# Altium project Q24_ECU.PrjPcb (part 1 of 2)
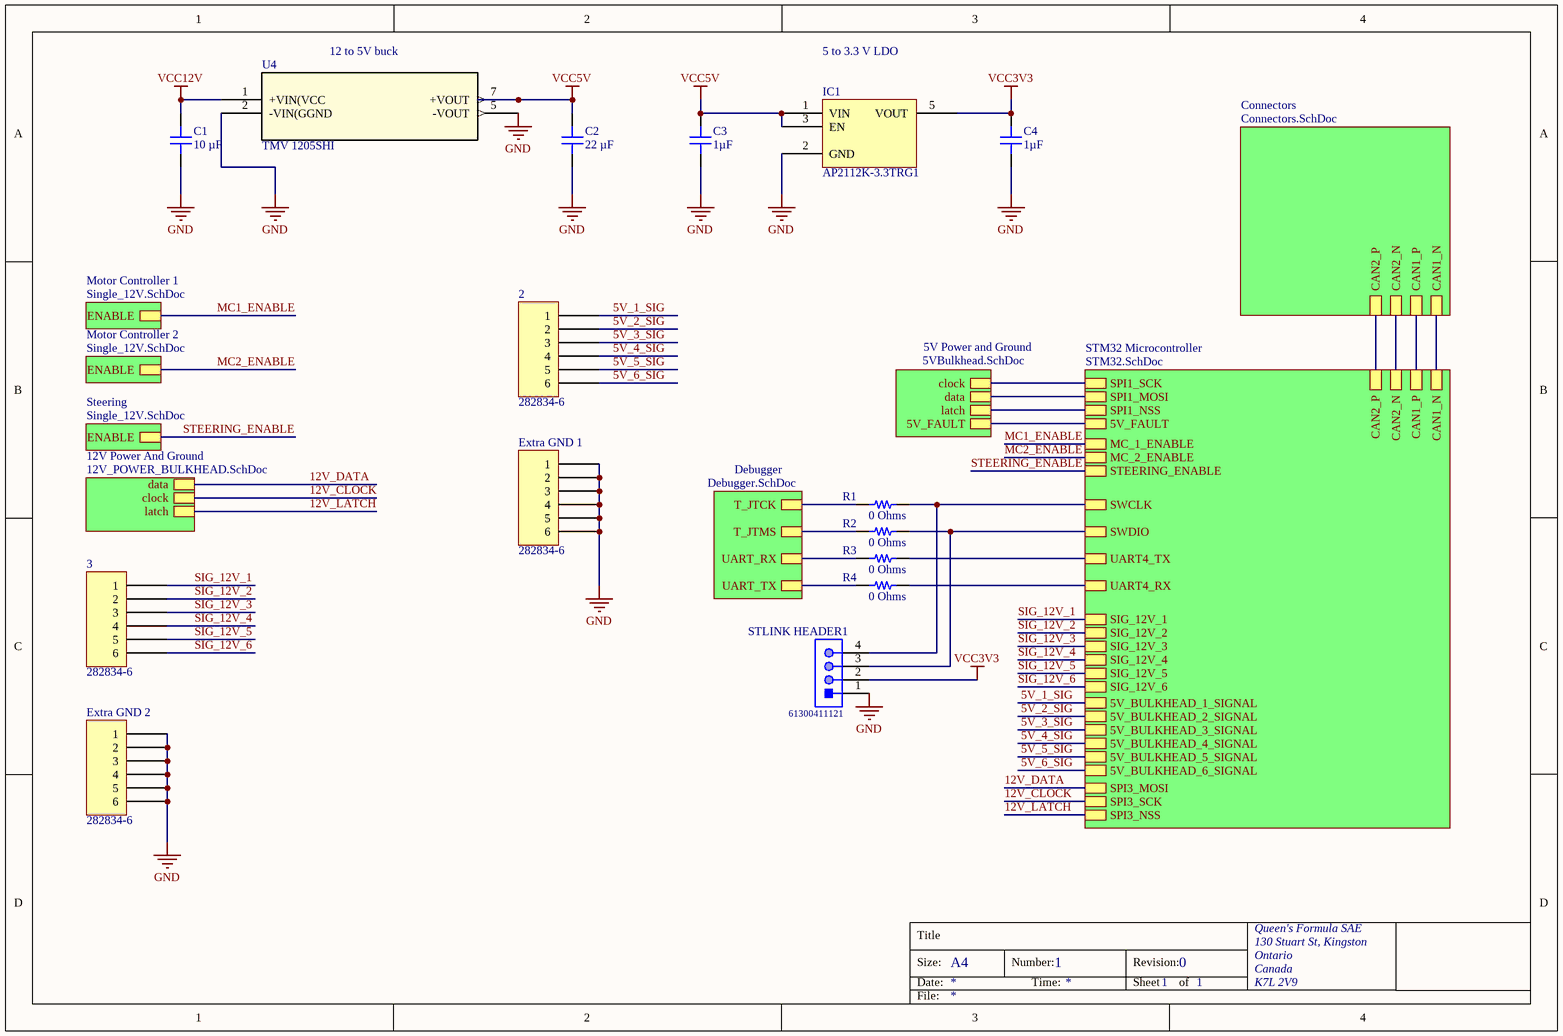
[diagram p0: TOP.SchDoc]
16 sheets, 186 parts. Net scope: hierarchical (ports join the sheet entries above them; power ports are global).
Board file: PCB.PcbDoc
Sheets:
  TOP.SchDoc
    STM32 Microcontroller = STM32.SchDoc
      CAN1 = CAN.SchDoc
      Accelerometer And Gyro = IMU.SchDoc
      CAN2 = CAN.SchDoc
    Motor Controller 1 = Single_12V.SchDoc
      Designator = 12V_LS.SchDoc
    Motor Controller 2 = Single_12V.SchDoc
      Designator = 12V_LS.SchDoc
    Steering = Single_12V.SchDoc
      Designator = 12V_LS.SchDoc
    Connectors = Connectors.SchDoc
    5V Power and Ground = 5VBulkhead.SchDoc
      Shift Register = shiftRegister.SchDoc
      5VLS1 = 5V_LS.SchDoc
      5VLS2 = 5V_LS.SchDoc
      5VLS3 = 5V_LS.SchDoc
      5VLS4 = 5V_LS.SchDoc
      5VLS5 = 5V_LS.SchDoc
      5VLS6 = 5V_LS.SchDoc
    Debugger = Debugger.SchDoc
      MCU = DebuggerMCU.SchDoc
      POWER = Power.SchDoc
      CONNECTORS = DebuggerConnectors.SchDoc
    12V Power And Ground = 12V_POWER_BULKHEAD.SchDoc
      Shift Register = shiftRegister.SchDoc
      Designator = 12V_LS.SchDoc
      Designator = 12V_LS.SchDoc
      Designator = 12V_LS.SchDoc
      Designator = 12V_LS.SchDoc
      Designator = 12V_LS.SchDoc
      Designator = 12V_LS.SchDoc
  Sheet1.SchDoc

## Sheet TOP.SchDoc: =DocumentName
size A4; Organization: Queen's Formula SAE; Address1: 130 Stuart St, Kingston; Address2: Ontario; Address3: Canada; Address4: K7L 2V9; DocumentNumber: 1; Revision: 0; SheetNumber: 1; SheetTotal: 1

### Parts
2  282834-6  [TE 282834-6]
3  282834-6  [TE 282834-6]
C1  10 µF  [CAP 0603_1608]
C2  22 µF  [CAP 0603_1608]
C3  1µF  [CAP 0402_1005]
C4  1µF  [CAP 0402_1005]
Extra_GND_1  282834-6  [TE 282834-6]
Extra_GND_2  282834-6  [TE 282834-6]
IC1  AP2112K-3.3TRG1  [DIODES SOT-23-5 W5]
R1  0 Ohms  [RES 0603_1608]
R2  0 Ohms  [RES 0603_1608]
R3  0 Ohms  [RES 0603_1608]
R4  0 Ohms  [RES 0603_1608]
STLINK_HEADER1  61300411121  [61300411121]
U4  TMV 1205SHI  [TMV-HI_SINGLE_TRP]

### Sub-sheets
5V Power and Ground = 5VBulkhead.SchDoc: data, clock, latch, 5V_FAULT
12V Power And Ground = 12V_POWER_BULKHEAD.SchDoc: data, clock, latch
Connectors = Connectors.SchDoc: CAN1_N, CAN1_P, CAN2_N, CAN2_P
Debugger = Debugger.SchDoc: T_JTCK, T_JTMS, UART_RX, UART_TX
Motor Controller 1 = Single_12V.SchDoc: ENABLE
Motor Controller 2 = Single_12V.SchDoc: ENABLE
Steering = Single_12V.SchDoc: ENABLE
STM32 Microcontroller = STM32.SchDoc: SPI1_NSS, SPI1_SCK, SPI1_MOSI, MC_1_ENABLE, MC_2_ENABLE, STEERING_ENABLE, CAN1_P, CAN1_N, 5V_BULKHEAD_1_SIGNAL, 5V_BULKHEAD_2_SIGNAL, 5V_BULKHEAD_3_SIGNAL, 5V_BULKHEAD_4_SIGNAL, 5V_BULKHEAD_5_SIGNAL, 5V_BULKHEAD_6_SIGNAL, CAN2_N, CAN2_P, SWCLK, SPI3_NSS, SPI3_MOSI, SPI3_SCK, SIG_12V_1, SIG_12V_2, SIG_12V_3, SIG_12V_4, SIG_12V_5, SIG_12V_6, SWDIO, UART4_TX, UART4_RX, 5V_FAULT

### Nets
GND: C1.1 C2.1 C3.1 C4.1 Extra_GND_1.1 Extra_GND_1.2 Extra_GND_1.3 Extra_GND_1.4 Extra_GND_1.5 Extra_GND_1.6 Extra_GND_2.1 Extra_GND_2.2 Extra_GND_2.3 Extra_GND_2.4 Extra_GND_2.5 Extra_GND_2.6 IC1.2(GND) STLINK_HEADER1.1 U4.2(-VIN(GGND) U4.5(-VOUT)
VCC3V3: C4.2 IC1.5(VOUT) STLINK_HEADER1.2
VCC5V: C2.2 C3.2 IC1.1(VIN) IC1.3(EN) U4.7(+VOUT)
VCC12V: C1.2 U4.1(+VIN(VCC)
5V_1_SIG: 2.1 ; sheet STM32 Microcontroller/5V_BULKHEAD_1_SIGNAL
5V_2_SIG: 2.2 ; sheet STM32 Microcontroller/5V_BULKHEAD_2_SIGNAL
5V_3_SIG: 2.3 ; sheet STM32 Microcontroller/5V_BULKHEAD_3_SIGNAL
5V_4_SIG: 2.4 ; sheet STM32 Microcontroller/5V_BULKHEAD_4_SIGNAL
5V_5_SIG: 2.5 ; sheet STM32 Microcontroller/5V_BULKHEAD_5_SIGNAL
5V_6_SIG: 2.6 ; sheet STM32 Microcontroller/5V_BULKHEAD_6_SIGNAL
12V_CLOCK: sheet STM32 Microcontroller/SPI3_SCK, sheet 12V Power And Ground/clock
12V_DATA: sheet STM32 Microcontroller/SPI3_MOSI, sheet 12V Power And Ground/data
12V_LATCH: sheet STM32 Microcontroller/SPI3_NSS, sheet 12V Power And Ground/latch
CAN1_N: sheet STM32 Microcontroller/CAN1_N, sheet Connectors/CAN1_N
CAN1_P: sheet STM32 Microcontroller/CAN1_P, sheet Connectors/CAN1_P
CAN2_N: sheet STM32 Microcontroller/CAN2_N, sheet Connectors/CAN2_N
CAN2_P: sheet STM32 Microcontroller/CAN2_P, sheet Connectors/CAN2_P
MC1_ENABLE: sheet STM32 Microcontroller/MC_1_ENABLE, sheet Motor Controller 1/ENABLE
MC2_ENABLE: sheet STM32 Microcontroller/MC_2_ENABLE, sheet Motor Controller 2/ENABLE
SIG_12V_1: 3.1 ; sheet STM32 Microcontroller/SIG_12V_1
SIG_12V_2: 3.2 ; sheet STM32 Microcontroller/SIG_12V_2
SIG_12V_3: 3.3 ; sheet STM32 Microcontroller/SIG_12V_3
SIG_12V_4: 3.4 ; sheet STM32 Microcontroller/SIG_12V_4
SIG_12V_5: 3.5 ; sheet STM32 Microcontroller/SIG_12V_5
SIG_12V_6: 3.6 ; sheet STM32 Microcontroller/SIG_12V_6
STEERING_ENABLE: sheet STM32 Microcontroller/STEERING_ENABLE, sheet Steering/ENABLE
T_JTCK: R1.1 ; sheet Debugger/T_JTCK
T_JTMS: R2.1 ; sheet Debugger/T_JTMS
UART_RX: R3.1 ; sheet Debugger/UART_RX
UART_TX: R4.1 ; sheet Debugger/UART_TX
NetIC2_14: R3.2 ; sheet STM32 Microcontroller/UART4_TX
NetIC2_15: R4.2 ; sheet STM32 Microcontroller/UART4_RX
NetIC2_20: sheet STM32 Microcontroller/SPI1_NSS, sheet 5V Power and Ground/latch
NetIC2_21: sheet STM32 Microcontroller/SPI1_SCK, sheet 5V Power and Ground/clock
NetIC2_23: sheet STM32 Microcontroller/SPI1_MOSI, sheet 5V Power and Ground/data
NetIC2_42: sheet STM32 Microcontroller/5V_FAULT, sheet 5V Power and Ground/5V_FAULT
NetIC2_46: R2.2 STLINK_HEADER1.3 ; sheet STM32 Microcontroller/SWDIO
NetIC2_49: R1.2 STLINK_HEADER1.4 ; sheet STM32 Microcontroller/SWCLK

### Notes on the sheet
- (near U4) 12 to 5V buck
- 5 to 3.3 V LDO
- Title
- Size:
- Date:
- A4
- Number:
- Time:
- Revision:
- Sheet
- of
- File:

### Library data of the parts
2 3 Extra_GND_1 Extra_GND_2 = 282834-6: TERM BLK 6P SIDE ENT 2.54MM PCB; Manufacturer: TE Connectivity AMP Connectors; Current: 10A; Mating Orientation: Horizontal with Board; Number of Levels: 1; Pitch: 0.100" (2.54mm); Positions Per Level: 6; Voltage: 150V; Wire Gauge: 16-30 AWG; Wire Termination: Screw - Rising Cage Clamp; Part Number: 282834-6; Color: Green; ComponentLink1Description: Datasheet; ComponentLink1URL: https://www.te.com/commerce/DocumentDelivery/DDEController?Action=srchrtrv&DocNm=282834&DocType=Customer+Drawing&DocLang=English; ComponentLink2Description: DigiKey Link; ComponentLink2URL: http://digikey.com/product-detail/en/te-connectivity-amp-connectors/282834-6/A98337-ND/1153267; LastUpdated: 2020-01-15 4:16:31 AM; Lifecycle Status: Active; Minimum Order: 1; Mounting Type: Through Hole; Packaging: Bulk; Part Status: Active; Price: 4.72; Series: Buchanan; Supplier 1: DigiKey; Supplier Part Number 1: A98337-ND
C1 = GRT188R61C106ME13D: CAP CER 10UF 16V X5R 0603; manufacturer: Murata Electronics; Tolerance: ±20%; Part Number: GRT188R61C106ME13D; Value: 10 µF; Applications: Automotive; Capacitance: 10 µF; componentlink1description: Datasheet; componentlink1url: https://search.murata.co.jp/Ceramy/image/img/A01X/G101/ENG/GRT188R61C106ME13-01.pdf; componentlink2description: DigiKey Link; componentlink2url: https://www.digikey.com/en/products/detail/murata-electronics/GRT188R61C106ME13D/5416740; Device Package: 0603 (1608 Metric); lastupdated: 2023-06-11 7:15:06 PM; Lifecycle Status: Active; Minimum Order: 1; Mounting Type: Surface Mount, MLCC; Operating Temperature: -55°C ~ 85°C; Package / Case: 0603 (1608 Metric); packaging: TapeAndReel; partid: 2515; Part Status: Active; price: 0.06; Ratings: AEC-Q200; series: GRT; Size / Dimension: 0.063" L x 0.031" W (1.60mm x 0.80mm); Supplier 1: DigiKey; Supplier Part Number 1: 490-12318-1-ND; Temperature Coefficient: X5R; Thickness (Max): 0.035" (0.90mm); Voltage - Rated: 16V
C2 = ZRB186R60J226ME11L: CAP CER 22UF 6.3V X5R 0603; manufacturer: Murata Electronics; Tolerance: ±20%; Part Number: ZRB186R60J226ME11L; Value: 22 µF; Applications: Acoustic Noise Reduction; Capacitance: 22 µF; componentlink1description: Datasheet; componentlink1url: https://psearch.en.murata.com/capacitor/product/ZRB186R60J226ME11%23.pdf; componentlink2description: DigiKey Link; componentlink2url: https://www.digikey.com/en/products/detail/murata-electronics/ZRB186R60J226ME11L/5877417; Device Package: 0603 (1608 Metric); Features: Interposer Termination; lastupdated: 2023-06-11 7:15:06 PM; Lifecycle Status: Active; Minimum Order: 1; Mounting Type: Surface Mount, MLCC; Operating Temperature: -55°C ~ 85°C; Package / Case: 0603 (1608 Metric); packaging: TapeAndReel; partid: 2449; Part Status: Active; price: 0.05; series: ZRB; Size / Dimension: 0.063" L x 0.031" W (1.60mm x 0.80mm); Supplier 1: DigiKey; Supplier Part Number 1: 490-13254-1-ND; Temperature Coefficient: X5R; Thickness (Max): 0.031" (0.80mm); Voltage - Rated: 6.3V
C3 C4 = 0402ZD105KAT4A: CAP CER 1UF 10V X5R 0402; Manufacturer: AVX Corporation; Tolerance: ±10%; Part Number: 0402ZD105KAT4A; Value: 1µF; Applications: General Purpose; Capacitance: 1µF; ComponentLink1Description: Datasheet; ComponentLink1URL: http://datasheets.avx.com/cx5r.pdf; ComponentLink2Description: DigiKey Link; ComponentLink2URL: http://digikey.com/product-detail/en/avx-corporation/0402ZD105KAT4A/478-10063-1-ND/6564285; Device Package: 0402 (1005 Metric); LastUpdated: 2020-09-02 1:02:25 AM; Lifecycle Status: Active; Minimum Order: 1; Mounting Type: Surface Mount, MLCC; Operating Temperature: -55°C ~ 85°C; Package / Case: 0402 (1005 Metric); Packaging: TapeAndReel; PartId: 1846; Part Status: Active; Price: 0.02; Series: -; Size / Dimension: 0.039" L x 0.020" W (1.00mm x 0.50mm); Supplier 1: DigiKey; Supplier Part Number 1: 478-10063-1-ND; Temperature Coefficient: X5R; Thickness (Max): 0.022" (0.56mm); Voltage - Rated: 10V
IC1 = AP2112K-3.3TRG1: IC REG LINEAR 3.3V 600MA SOT25; Manufacturer: Diodes Incorporated; Control Features: Enable; Current - Quiescent (Iq): 80µA; Number of Regulators: 1; Output Configuration: Positive; Output Type: Fixed; Protection Features: Over Current, Over Temperature; PSRR: 65sB (100Hz ~ 1KHz); Voltage Dropout (Max): 0.4V @ 600mA; Voltage - Input (Max): 6V; Part Number: AP2112K-3.3TRG1; ComponentLink1Description: Datasheet; ComponentLink1URL: https://www.diodes.com/assets/Datasheets/AP2112.pdf; ComponentLink2Description: DigiKey Link; ComponentLink2URL: http://digikey.com/product-detail/en/diodes-incorporated/AP2112K-3.3TRG1/AP2112K-3.3TRG1DICT-ND/4505257; Current - Output: 600mA; LastUpdated: 2020-09-02 1:25:56 AM; Lifecycle Status: Active; Minimum Order: 1; Mounting Type: Surface Mount; Operating Temperature: -40°C ~ 85°C; Package / Case: SC-74A, SOT-753; Packaging: TapeAndReel; Part Status: Active; Price: 0.10; Series: -; Supplier 1: DigiKey; Supplier Part Number 1: AP2112K-3.3TRG1DICT-ND; Supplier Device Package: SOT-25; Voltage - Output (Min/Fixed): 3.3V
R1-R4 = TLRZ1JTTD: RES 0 OHM JUMPER 0603; Manufacturer: KOA Speer Electronics, Inc.; Part Number: TLRZ1JTTD; Value: 0 Ohms; ComponentLink1Description: Datasheet; ComponentLink1URL: http://www.koaspeer.com/catimages/Products/TLRZ/TLRZ.pdf; ComponentLink2Description: DigiKey Link; ComponentLink2URL: https://www.digikey.com/en/products/detail/koa-speer-electronics-inc/TLRZ1JTTD/9845493; Composition: Metal Element; Device Package: 0603 (1608 Metric); Features: Automotive AEC-Q200, Current Sense; Height - Seated (Max): 0.022" (0.55mm); LastUpdated: 2023-06-11 7:43:49 PM; Lifecycle Status: Active; Minimum Order: 1; Number of Terminations: 2; Operating Temperature: -55°C ~ 170°C; Package / Case: 0603 (1608 Metric); Packaging: TapeAndReel; PartId: 4851; Part Status: Active; Price: 0.08; Ratings: AEC-Q200; Resistance: 0 Ohms; Series: TLRZ; Size / Dimension: 0.063" L x 0.031" W (1.60mm x 0.80mm); Supplier 1: DigiKey; Supplier Part Number 1: 2019-TLRZ1JTTDCT-ND; Supplier Device Package: 0603; Tolerance: Jumper
STLINK_HEADER1 = CMP-1502-01064-1: THT Vertical Pin Header WR-PHD, Pitch 2.54 mm, Single Row, 4 pins; Manufacturer: Wurth Elektronik; Withstanding Voltage: 500VAC; Rated Current: 3A; Working Voltage: 250VAC; Pin Number: 4; Gender: Male; Contact Resistance: 20mOhm; Pitch: 2.54mm; Manufacturer URL: http://www.we-online.de; Operating Temperature: -40to105degC; Packaging: Bag; Mounting Technology: THT; Package Reference: 61300411121; Datasheet URL: https://katalog.we-online.de/em/datasheet/6130xx11121.pdf; Publisher: WurthElektronik; Part Number: 61300411121; Row Number: Single; Orientation: Vertical
U4 = CMP-01539-51129758-1: TMV 1205SHI Iso DC-DC Converter; Vin 10.8 to 13.2Vdc; Vout 5Vdc; I/O isolation 5200Vdc; Output Current: 200mA; Isolation Voltage: 5.2kV; Number of Outputs: 1; Output Voltage: 5V; Efficiency: 71%; Output Power: 1W; Max Operating Temperature: 85°C; Height: 10.2mm; Width: 7.5mm; Mount: Through Hole; Depth: 10.2mm; NexarPartId: 51129758; RoHS: Compliant; Min Operating Temperature: -40°C; Length: 19.5mm

## Sheet STM32.SchDoc
size A4
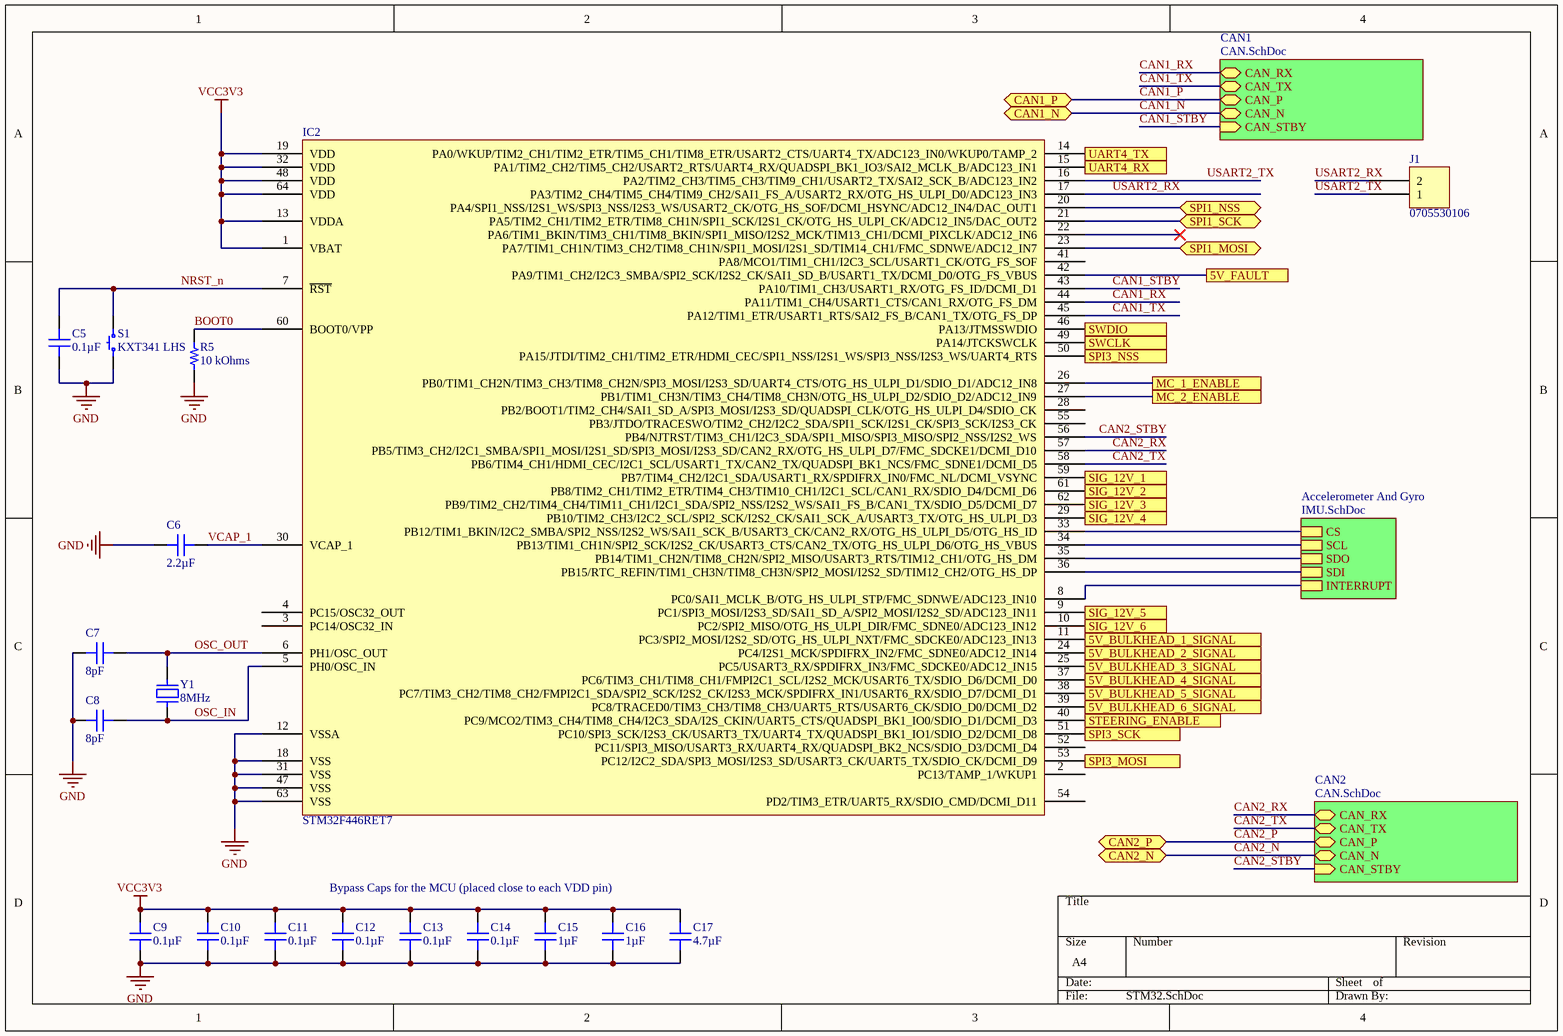
[diagram p1: STM32.SchDoc]

### Parts
C5  0.1µF  [CAP 0402_1005]
C6  2.2µF  [CAP 0402_1005]
C7  8pF  [CAP 0402_1005]
C8  8pF  [CAP 0402_1005]
C9  0.1µF  [CAP 0402_1005]
C10  0.1µF  [CAP 0402_1005]
C11  0.1µF  [CAP 0402_1005]
C12  0.1µF  [CAP 0402_1005]
C13  0.1µF  [CAP 0402_1005]
C14  0.1µF  [CAP 0402_1005]
C15  1µF  [CAP 0402_1005]
C16  1µF  [CAP 0402_1005]
C17  4.7µF  [CAP 0402_1005]
IC2  STM32F446RET7  [ST LQFP-64 10X10MM]
J1  0705530106  [MOLEX SDA-70553-2PIN]
R5  10 kOhms  [RES 0402_1005]
S1  KXT341 LHS  [C&K KXT3]
Y1  8MHz  [NDK NX3225GD]

### Sub-sheets
Accelerometer And Gyro = IMU.SchDoc: CS, SCL, SDO, SDI, INTERRUPT
CAN1 = CAN.SchDoc: CAN_RX (bidir), CAN_TX (bidir), CAN_STBY (in), CAN_P (bidir), CAN_N (bidir)
CAN2 = CAN.SchDoc: CAN_RX (bidir), CAN_TX (bidir), CAN_STBY (in), CAN_P (bidir), CAN_N (bidir)

### Ports
5V_BULKHEAD_1_SIGNAL, 5V_BULKHEAD_2_SIGNAL, 5V_BULKHEAD_3_SIGNAL, 5V_BULKHEAD_4_SIGNAL, 5V_BULKHEAD_5_SIGNAL, 5V_BULKHEAD_6_SIGNAL, 5V_FAULT, CAN1_N (bidir), CAN1_P (bidir), CAN2_N (bidir), CAN2_P (bidir), MC_1_ENABLE, MC_2_ENABLE, SIG_12V_1, SIG_12V_2, SIG_12V_3, SIG_12V_4, SIG_12V_5, SIG_12V_6, SPI1_MOSI (bidir), SPI1_NSS (bidir), SPI1_SCK (bidir), SPI3_MOSI, SPI3_NSS, SPI3_SCK, STEERING_ENABLE, SWCLK, SWDIO, UART4_RX, UART4_TX

### Nets
GND: C5.1 C6.2 C7.1 C8.1 C9.1 C10.1 C11.1 C12.1 C13.1 C14.1 C15.1 C16.1 C17.1 IC2.12(VSSA) IC2.18(VSS) IC2.31(VSS) IC2.47(VSS) IC2.63(VSS) R5.1 S1.1
VCC3V3: C9.2 C10.2 C11.2 C12.2 C13.2 C14.2 C15.2 C16.2 C17.2 IC2.1(VBAT) IC2.13(VDDA) IC2.19(VDD) IC2.32(VDD) IC2.48(VDD) IC2.64(VDD)
5V_1_SIG: IC2.11(PC3/SPI2_MOSI/I2S2_SD/OTG_HS_ULPI_NXT/FMC_SDCKE0/ADC123_IN13) ; port 5V_BULKHEAD_1_SIGNAL
5V_2_SIG: IC2.24(PC4/I2S1_MCK/SPDIFRX_IN2/FMC_SDNE0/ADC12_IN14) ; port 5V_BULKHEAD_2_SIGNAL
5V_3_SIG: IC2.25(PC5/USART3_RX/SPDIFRX_IN3/FMC_SDCKE0/ADC12_IN15) ; port 5V_BULKHEAD_3_SIGNAL
5V_4_SIG: IC2.37(PC6/TIM3_CH1/TIM8_CH1/FMPI2C1_SCL/I2S2_MCK/USART6_TX/SDIO_D6/DCMI_D0) ; port 5V_BULKHEAD_4_SIGNAL
5V_5_SIG: IC2.38(PC7/TIM3_CH2/TIM8_CH2/FMPI2C1_SDA/SPI2_SCK/I2S2_CK/I2S3_MCK/SPDIFRX_IN1/USART6_RX/SDIO_D7/DCMI_D1) ; port 5V_BULKHEAD_5_SIGNAL
5V_6_SIG: IC2.39(PC8/TRACED0/TIM3_CH3/TIM8_CH3/UART5_RTS/USART6_CK/SDIO_D0/DCMI_D2) ; port 5V_BULKHEAD_6_SIGNAL
12V_CLOCK: IC2.51(PC10/SPI3_SCK/I2S3_CK/USART3_TX/UART4_TX/QUADSPI_BK1_IO1/SDIO_D2/DCMI_D8) ; port SPI3_SCK
12V_DATA: IC2.53(PC12/I2C2_SDA/SPI3_MOSI/I2S3_SD/USART3_CK/UART5_TX/SDIO_CK/DCMI_D9) ; port SPI3_MOSI
12V_LATCH: IC2.50(PA15/JTDI/TIM2_CH1/TIM2_ETR/HDMI_CEC/SPI1_NSS/I2S1_WS/SPI3_NSS/I2S3_WS/UART4_RTS) ; port SPI3_NSS
BOOT0: IC2.60(BOOT0/VPP) R5.2
CAN1_N: port CAN1_N, sheet CAN1/CAN_N
CAN1_P: port CAN1_P, sheet CAN1/CAN_P
CAN1_RX: IC2.44(PA11/TIM1_CH4/USART1_CTS/CAN1_RX/OTG_FS_DM) ; sheet CAN1/CAN_RX
CAN1_STBY: IC2.43(PA10/TIM1_CH3/USART1_RX/OTG_FS_ID/DCMI_D1) ; sheet CAN1/CAN_STBY
CAN1_TX: IC2.45(PA12/TIM1_ETR/USART1_RTS/SAI2_FS_B/CAN1_TX/OTG_FS_DP) ; sheet CAN1/CAN_TX
CAN2_N: port CAN2_N, sheet CAN2/CAN_N
CAN2_P: port CAN2_P, sheet CAN2/CAN_P
CAN2_RX: IC2.57(PB5/TIM3_CH2/I2C1_SMBA/SPI1_MOSI/I2S1_SD/SPI3_MOSI/I2S3_SD/CAN2_RX/OTG_HS_ULPI_D7/FMC_SDCKE1/DCMI_D10) ; sheet CAN2/CAN_RX
CAN2_STBY: IC2.56(PB4/NJTRST/TIM3_CH1/I2C3_SDA/SPI1_MISO/SPI3_MISO/SPI2_NSS/I2S2_WS) ; sheet CAN2/CAN_STBY
CAN2_TX: IC2.58(PB6/TIM4_CH1/HDMI_CEC/I2C1_SCL/USART1_TX/CAN2_TX/QUADSPI_BK1_NCS/FMC_SDNE1/DCMI_D5) ; sheet CAN2/CAN_TX
MC1_ENABLE: IC2.26(PB0/TIM1_CH2N/TIM3_CH3/TIM8_CH2N/SPI3_MOSI/I2S3_SD/UART4_CTS/OTG_HS_ULPI_D1/SDIO_D1/ADC12_IN8) ; port MC_1_ENABLE
MC2_ENABLE: IC2.27(PB1/TIM1_CH3N/TIM3_CH4/TIM8_CH3N/OTG_HS_ULPI_D2/SDIO_D2/ADC12_IN9) ; port MC_2_ENABLE
NRST_n: C5.2 IC2.7(~{RST}) S1.2
OSC_IN: C8.2 IC2.5(PH0/OSC_IN) Y1.1
OSC_OUT: C7.2 IC2.6(PH1/OSC_OUT) Y1.2
SIG_12V_1: IC2.59(PB7/TIM4_CH2/I2C1_SDA/USART1_RX/SPDIFRX_IN0/FMC_NL/DCMI_VSYNC) ; port SIG_12V_1
SIG_12V_2: IC2.61(PB8/TIM2_CH1/TIM2_ETR/TIM4_CH3/TIM10_CH1/I2C1_SCL/CAN1_RX/SDIO_D4/DCMI_D6) ; port SIG_12V_2
SIG_12V_3: IC2.62(PB9/TIM2_CH2/TIM4_CH4/TIM11_CH1/I2C1_SDA/SPI2_NSS/I2S2_WS/SAI1_FS_B/CAN1_TX/SDIO_D5/DCMI_D7) ; port SIG_12V_3
SIG_12V_4: IC2.29(PB10/TIM2_CH3/I2C2_SCL/SPI2_SCK/I2S2_CK/SAI1_SCK_A/USART3_TX/OTG_HS_ULPI_D3) ; port SIG_12V_4
SIG_12V_5: IC2.9(PC1/SPI3_MOSI/I2S3_SD/SAI1_SD_A/SPI2_MOSI/I2S2_SD/ADC123_IN11) ; port SIG_12V_5
SIG_12V_6: IC2.10(PC2/SPI2_MISO/OTG_HS_ULPI_DIR/FMC_SDNE0/ADC123_IN12) ; port SIG_12V_6
STEERING_ENABLE: IC2.40(PC9/MCO2/TIM3_CH4/TIM8_CH4/I2C3_SDA/I2S_CKIN/UART5_CTS/QUADSPI_BK1_IO0/SDIO_D1/DCMI_D3) ; port STEERING_ENABLE
USART2_RX: IC2.17(PA3/TIM2_CH4/TIM5_CH4/TIM9_CH2/SAI1_FS_A/USART2_RX/OTG_HS_ULPI_D0/ADC123_IN3) J1.2
USART2_TX: IC2.16(PA2/TIM2_CH3/TIM5_CH3/TIM9_CH1/USART2_TX/SAI2_SCK_B/ADC123_IN2) J1.1
VCAP_1: C6.1 IC2.30(VCAP_1)
NetIC2_8: IC2.8(PC0/SAI1_MCLK_B/OTG_HS_ULPI_STP/FMC_SDNWE/ADC123_IN10) ; sheet Accelerometer And Gyro/INTERRUPT
NetIC2_14: IC2.14(PA0/WKUP/TIM2_CH1/TIM2_ETR/TIM5_CH1/TIM8_ETR/USART2_CTS/UART4_TX/ADC123_IN0/WKUP0/TAMP_2) ; port UART4_TX
NetIC2_15: IC2.15(PA1/TIM2_CH2/TIM5_CH2/USART2_RTS/UART4_RX/QUADSPI_BK1_IO3/SAI2_MCLK_B/ADC123_IN1) ; port UART4_RX
NetIC2_20: IC2.20(PA4/SPI1_NSS/I2S1_WS/SPI3_NSS/I2S3_WS/USART2_CK/OTG_HS_SOF/DCMI_HSYNC/ADC12_IN4/DAC_OUT1) ; port SPI1_NSS
NetIC2_21: IC2.21(PA5/TIM2_CH1/TIM2_ETR/TIM8_CH1N/SPI1_SCK/I2S1_CK/OTG_HS_ULPI_CK/ADC12_IN5/DAC_OUT2) ; port SPI1_SCK
NetIC2_23: IC2.23(PA7/TIM1_CH1N/TIM3_CH2/TIM8_CH1N/SPI1_MOSI/I2S1_SD/TIM14_CH1/FMC_SDNWE/ADC12_IN7) ; port SPI1_MOSI
NetIC2_33: IC2.33(PB12/TIM1_BKIN/I2C2_SMBA/SPI2_NSS/I2S2_WS/SAI1_SCK_B/USART3_CK/CAN2_RX/OTG_HS_ULPI_D5/OTG_HS_ID) ; sheet Accelerometer And Gyro/CS
NetIC2_34: IC2.34(PB13/TIM1_CH1N/SPI2_SCK/I2S2_CK/USART3_CTS/CAN2_TX/OTG_HS_ULPI_D6/OTG_HS_VBUS) ; sheet Accelerometer And Gyro/SCL
NetIC2_35: IC2.35(PB14/TIM1_CH2N/TIM8_CH2N/SPI2_MISO/USART3_RTS/TIM12_CH1/OTG_HS_DM) ; sheet Accelerometer And Gyro/SDO
NetIC2_36: IC2.36(PB15/RTC_REFIN/TIM1_CH3N/TIM8_CH3N/SPI2_MOSI/I2S2_SD/TIM12_CH2/OTG_HS_DP) ; sheet Accelerometer And Gyro/SDI
NetIC2_42: IC2.42(PA9/TIM1_CH2/I2C3_SMBA/SPI2_SCK/I2S2_CK/SAI1_SD_B/USART1_TX/DCMI_D0/OTG_FS_VBUS) ; port 5V_FAULT
NetIC2_46: IC2.46(PA13/JTMSSWDIO) ; port SWDIO
NetIC2_49: IC2.49(PA14/JTCKSWCLK) ; port SWCLK

Not connected (* = marked no-connect by the designer): IC2 2(PC13/TAMP_1/WKUP1) 3(PC14/OSC32_IN) 4(PC15/OSC32_OUT) 22(PA6/TIM1_BKIN/TIM3_CH1/TIM8_BKIN/SPI1_MISO/I2S2_MCK/TIM13_CH1/DCMI_PIXCLK/ADC12_IN6)* 28(PB2/BOOT1/TIM2_CH4/SAI1_SD_A/SPI3_MOSI/I2S3_SD/QUADSPI_CLK/OTG_HS_ULPI_D4/SDIO_CK) 41(PA8/MCO1/TIM1_CH1/I2C3_SCL/USART1_CK/OTG_FS_SOF) 52(PC11/SPI3_MISO/USART3_RX/UART4_RX/QUADSPI_BK2_NCS/SDIO_D3/DCMI_D4) 54(PD2/TIM3_ETR/UART5_RX/SDIO_CMD/DCMI_D11) 55(PB3/JTDO/TRACESWO/TIM2_CH2/I2C2_SDA/SPI1_SCK/I2S1_CK/SPI3_SCK/I2S3_CK)

### Notes on the sheet
- Bypass Caps for the MCU (placed close to each VDD pin)

### Library data of the parts
C5 C9-C14 = C0402C104K4RECAUTO: CAP CER 0402 0.1UF 16V X7R 10%; Manufacturer: KEMET; Part Number: C0402C104K4RECAUTO; Value: 0.1µF; Applications: Automotive, ESD Protection; Capacitance: 0.1µF; ComponentLink1Description: Datasheet; ComponentLink1URL: https://api.kemet.com/component-edge/download/datasheet/C0402C104K4RECAUTO.pdf; ComponentLink2Description: DigiKey Link; ComponentLink2URL: http://digikey.com/product-detail/en/kemet/C0402C104K4RECAUTO/399-17167-1-ND/8563708; Device Package: 0402 (1005 Metric); LastUpdated: 2020-09-02 1:02:25 AM; Lifecycle Status: Active; Minimum Order: 1; Mounting Type: Surface Mount, MLCC; Operating Temperature: -55°C ~ 125°C; Package / Case: 0402 (1005 Metric); Packaging: TapeAndReel; PartId: 1731; Part Status: Active; Price: 0.02; Series: ESD SMD Auto X7R; Size / Dimension: 0.039" L x 0.020" W (1.00mm x 0.50mm); Supplier 1: DigiKey; Supplier Part Number 1: 399-17167-1-ND; Temperature Coefficient: X7R; Thickness (Max): 0.022" (0.55mm); Tolerance: ±10%; Voltage - Rated: 16V; Ratings: AEC-Q200
C6 = CL05A225KO5NQNC: CAP CER 2.2UF 16V X5R 0402; Manufacturer: Samsung Electro-Mechanics; Tolerance: ±10%; Part Number: CL05A225KO5NQNC; Value: 2.2µF; Applications: General Purpose; Capacitance: 2.2µF; ComponentLink1Description: Datasheet; ComponentLink1URL: http://www.samsungsem.com/kr/support/product-search/mlcc/CL05A225KO5NQNC.jsp; ComponentLink2Description: DigiKey Link; ComponentLink2URL: http://digikey.com/product-detail/en/samsung-electro-mechanics/CL05A225KO5NQNC/1276-1461-1-ND/3889547; Device Package: 0402 (1005 Metric); LastUpdated: 2020-09-02 1:02:25 AM; Lifecycle Status: Active; Minimum Order: 1; Mounting Type: Surface Mount, MLCC; Operating Temperature: -55°C ~ 85°C; Package / Case: 0402 (1005 Metric); Packaging: TapeAndReel; PartId: 1761; Part Status: Active; Price: 0.10; Series: CL; Size / Dimension: 0.039" L x 0.020" W (1.00mm x 0.50mm); Supplier 1: DigiKey; Supplier Part Number 1: 1276-1461-1-ND; Temperature Coefficient: X5R; Thickness (Max): 0.022" (0.55mm); Voltage - Rated: 16V
C7 C8 = C1005NP01H080D050BA: CAP CER 8PF 50V NP0 0402; Manufacturer: TDK Corporation; Temperature Coefficient: C0G, NP0; Tolerance: ±0.5pF; Part Number: C1005NP01H080D050BA; Value: 8pF; Applications: General Purpose; Capacitance: 8pF; ComponentLink1Description: Datasheet; ComponentLink1URL: https://product.tdk.com/info/en/catalog/datasheets/mlcc_commercial_hightemp_en.pdf?ref_disty=digikey; ComponentLink2Description: DigiKey Link; ComponentLink2URL: http://digikey.com/product-detail/en/tdk-corporation/C1005NP01H080D050BA/445-13781-1-ND/3955447; Device Package: 0402 (1005 Metric); Features: High Temperature; LastUpdated: 2020-09-02 1:02:24 AM; Lifecycle Status: Active; Minimum Order: 1; Mounting Type: Surface Mount, MLCC; Operating Temperature: -55°C ~ 150°C; Package / Case: 0402 (1005 Metric); Packaging: TapeAndReel; PartId: 2033; Part Status: Active; Price: 0.01; Series: C; Size / Dimension: 0.039" L x 0.020" W (1.00mm x 0.50mm); Supplier 1: DigiKey; Supplier Part Number 1: 445-13781-1-ND; Thickness (Max): 0.022" (0.55mm); Voltage - Rated: 50V
C15 C16 = CGB2A1X5R1A105K033BC: CAP CER 1UF 10V X5R 0402; Manufacturer: TDK Corporation; Tolerance: ±10%; Part Number: CGB2A1X5R1A105K033BC; Value: 1µF; Applications: General Purpose; Capacitance: 1µF; ComponentLink1Description: Datasheet; ComponentLink1URL: https://product.tdk.com/info/en/catalog/datasheets/mlcc_commercial_lowprofile_en.pdf?ref_disty=digikey; ComponentLink2Description: DigiKey Link; ComponentLink2URL: http://digikey.com/product-detail/en/tdk-corporation/CGB2A1X5R1A105K033BC/445-13179-1-ND/3954845; Device Package: 0402 (1005 Metric); LastUpdated: 2020-09-02 1:02:25 AM; Lifecycle Status: Active; Minimum Order: 1; Mounting Type: Surface Mount, MLCC; Operating Temperature: -55°C ~ 85°C; Package / Case: 0402 (1005 Metric); Packaging: TapeAndReel; PartId: 1796; Part Status: Active; Price: 0.02; Series: CGB; Size / Dimension: 0.039" L x 0.020" W (1.00mm x 0.50mm); Supplier 1: DigiKey; Supplier Part Number 1: 445-13179-1-ND; Temperature Coefficient: X5R; Thickness (Max): 0.013" (0.33mm); Voltage - Rated: 10V; Features: Low Profile
C17 = C1005X5R1A475K050BC: CAP CER 4.7UF 10V X5R 0402; Manufacturer: TDK Corporation; Tolerance: ±10%; Part Number: C1005X5R1A475K050BC; Value: 4.7µF; Applications: General Purpose; Capacitance: 4.7µF; ComponentLink1Description: Datasheet; ComponentLink1URL: https://product.tdk.com/info/en/catalog/datasheets/mlcc_commercial_general_en.pdf?ref_disty=digikey; ComponentLink2Description: DigiKey Link; ComponentLink2URL: http://digikey.com/product-detail/en/tdk-corporation/C1005X5R1A475K050BC/445-13820-1-ND/3955486; Device Package: 0402 (1005 Metric); LastUpdated: 2020-09-02 1:02:25 AM; Lifecycle Status: Active; Minimum Order: 1; Mounting Type: Surface Mount, MLCC; Operating Temperature: -55°C ~ 85°C; Package / Case: 0402 (1005 Metric); Packaging: TapeAndReel; PartId: 1759; Part Status: Active; Price: 0.10; Series: C; Size / Dimension: 0.039" L x 0.020" W (1.00mm x 0.50mm); Supplier 1: DigiKey; Supplier Part Number 1: 445-13820-1-ND; Temperature Coefficient: X5R; Thickness (Max): 0.022" (0.55mm); Voltage - Rated: 10V; Features: Low ESL
IC2 = STM32F446RET7: IC MCU 32BIT 512KB FLASH 64LQFP; Manufacturer: STMicroelectronics; Connectivity: CANbus, EBI/EMI, I²C, IrDA, LINbus, SAI, SD, SPDIF-Rx, SPI, UART/USART, USB, USB OTG; Core Processor: ARM® Cortex®-M4; Core Size: 32-Bit; Data Converters: A/D 16x12b; D/A 2x12b; Number of I/O: 50; Oscillator Type: Internal; Peripherals: Brown-out Detect/Reset, DMA, I²S, LVD, POR, PWM, WDT; Program Memory Size: 512KB (512K x 8); RAM Size: 128K x 8; Speed: 180MHz; Voltage - Supply (Vcc/Vdd): 1.7V ~ 3.6V; Part Number: STM32F446RET7; ComponentLink1Description: Datasheet; ComponentLink1URL: http://www.st.com/content/ccc/resource/technical/document/datasheet/65/cb/75/50/53/d6/48/24/DM00141306.pdf/files/DM00141306.pdf/jcr:content/translations/en.DM00141306.pdf; ComponentLink2Description: DigiKey Link; ComponentLink2URL: http://digikey.com/product-detail/en/stmicroelectronics/STM32F446RET7/497-16775-ND/6207480; Device Package: 64-LQFP; LastUpdated: 2020-08-30 9:03:14 PM; Lifecycle Status: Active; Minimum Order: 1; Mounting Type: Surface Mount; Package / Case: 64-LQFP; Packaging: Tray; PartId: 220; Price: 8.42; Program Memory Type: FLASH; Series: STM32F4; Supplier 1: DigiKey; Supplier Part Number 1: 497-16775-ND; Supplier Device Package: 64-LQFP (10x10)
J1 = 0705530106: CONN HEADER R/A 2POS 2.54MM; Manufacturer: Molex; Contact Length - Mating: 0.240" (6.10mm); Contact Length - Post: 0.130" (3.30mm); Material Flammability Rating: UL94 V-0; Number of Positions: 2; Number of Positions Loaded: All; Pitch - Mating: 0.100" (2.54mm); Shrouding: Shrouded - 4 Wall; Style: Board to Cable/Wire; Voltage Rating: 250V; Part Number: 0705530106; ComponentLink1Description: Datasheet; ComponentLink1URL: https://www.molex.com/pdm_docs/sd/705530106_sd.pdf; ComponentLink2Description: DigiKey Link; ComponentLink2URL: http://digikey.com/product-detail/en/molex/0705530106/WM4153-ND/1643386; Connector Type: Header; Contact Finish - Mating: Gold; Contact Finish - Post: Tin; Contact Finish Thickness - Mating: 30.0µin (0.76µm); Contact Material: Phosphor Bronze; Contact Shape: Square; Contact Type: Male Pin; Fastening Type: Latch Holder; Insulation Color: Black; Insulation Height: 0.215" (5.45mm); Insulation Material: Polyester, Glass Filled; LastUpdated: 2020-01-12 11:55:40 PM; Lifecycle Status: Active; Minimum Order: 1; Mounting Type: Through Hole, Right Angle; Number of Rows: 1; Operating Temperature: -40°C ~ 105°C; Packaging: Tube; PartId: 85; Part Status: Active; Price: 1.38; Series: SL 70553; Supplier 1: DigiKey; Supplier Part Number 1: WM4153-ND; Termination: Solder
R5 = CRCW040210K0DHEDP: RES SMD 10K OHM 0.5% 1/16W 0402; Manufacturer: Vishay Dale; Power (Watts): 0.063W, 1/16W; Temperature Coefficient: ±50ppm/°C; Part Number: CRCW040210K0DHEDP; Value: 10 kOhms; ComponentLink1Description: Datasheet; ComponentLink1URL: http://www.vishay.com/docs/20036/dcrcwpe3.pdf; ComponentLink2Description: DigiKey Link; ComponentLink2URL: http://digikey.com/product-detail/en/vishay-dale/CRCW040210K0DHEDP/541-10KAVCT-ND/3593906; Composition: Thick Film; Device Package: 0402 (1005 Metric); Height - Seated (Max): 0.016" (0.40mm); LastUpdated: 2020-09-02 1:08:05 AM; Lifecycle Status: Active; Minimum Order: 1; Number of Terminations: 2; Operating Temperature: -55°C ~ 155°C; Package / Case: 0402 (1005 Metric); Packaging: TapeAndReel; PartId: 5057; Part Status: Active; Price: 0.03; Resistance: 10 kOhms; Series: CRCW-P; Size / Dimension: 0.039" L x 0.020" W (1.00mm x 0.50mm); Supplier 1: DigiKey; Supplier Part Number 1: 541-10KAVCT-ND; Supplier Device Package: 0402; Tolerance: ±0.5%; Features: Automotive AEC-Q200; Ratings: AEC-Q200
S1 = KXT341 LHS: SWITCH TACTILE SPST-NO 0.02A 15V; Manufacturer: C&K; Actuator Height off PCB, Vertical: 0.60mm; Actuator Orientation: Top Actuated; Actuator Type: Standard; Contact Rating @ Voltage: 0.02A @ 15VDC; Illumination: Non-Illuminated; Operating Force: 330gf; Outline: 3.00mm x 2.00mm; Switch Function: Off-Mom; Part Number: KXT341 LHS; Circuit: SPST-NO; ComponentLink1Description: Datasheet; ComponentLink1URL: https://dznh3ojzb2azq.cloudfront.net/products/Tactile/KXT3/documents/datasheet.pdf; ComponentLink2Description: DigiKey Link; ComponentLink2URL: http://digikey.com/product-detail/en/c-k/KXT341-LHS/CKN10781CT-ND/6607324; LastUpdated: 2020-09-02 1:27:07 AM; Lifecycle Status: Active; Minimum Order: 1; Mounting Type: Surface Mount; Operating Temperature: -40°C ~ 85°C; Packaging: TapeAndReel; Part Status: Active; Price: 0.14; Series: KXT3; Supplier 1: DigiKey; Supplier Part Number 1: CKN10781CT-ND; Termination Style: SMD (SMT) Tab
Y1 = NX3225GD-8MHZ-STD-CRA-3: CRYSTAL 8.0000MHZ 8PF SMD; Manufacturer: NDK America, Inc.; ESR (Equivalent Series Resistance): 500 Ohms; Frequency Stability: ±150ppm; Frequency Tolerance: ±50ppm; Operating Mode: Fundamental; Part Number: NX3225GD-8MHZ-STD-CRA-3; ComponentLink1Description: Datasheet; ComponentLink1URL: http://www.ndk.com/images/products/catalog/c_NX3225GD-STD-CRA-3_e.pdf; ComponentLink2Description: DigiKey Link; ComponentLink2URL: http://digikey.com/product-detail/en/ndk-america-inc/NX3225GD-8MHZ-STD-CRA-3/644-1178-1-ND/3125567; Frequency: 8MHz; Height - Seated (Max): 0.039" (1.00mm); LastUpdated: 2020-09-02 1:25:56 AM; Lifecycle Status: Active; Load Capacitance: 8pF; Minimum Order: 1; Mounting Type: Surface Mount; Operating Temperature: -40°C ~ 150°C; Package / Case: 2-SMD, No Lead; Packaging: TapeAndReel; PartId: 744; Part Status: Active; Price: 0.48; Ratings: AEC-Q200; Series: NX3225GD; Size / Dimension: 0.126" L x 0.098" W (3.20mm x 2.50mm); Supplier 1: DigiKey; Supplier Part Number 1: 644-1178-1-ND; Type: MHz Crystal; Value: 8MHz

## Sheet CAN.SchDoc
size A4
Used 2 times, as channels STM32 Microcontroller/CAN1, STM32 Microcontroller/CAN2. Parts and nets are listed once, with the designators drawn on the sheet.
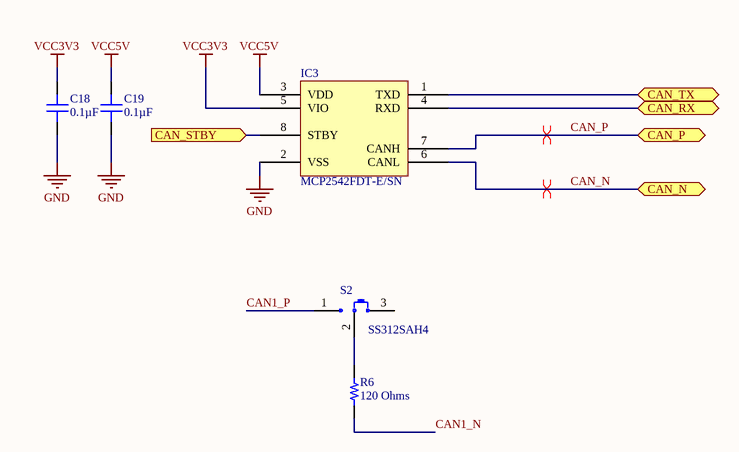
[diagram p2: CAN.SchDoc]

### Parts
C18  0.1µF  [CAP 0201_0603]
C19  0.1µF  [CAP 0201_0603]
IC3  MCP2542FDT-E/SN  [MICROCHIP SOIC-8 150MIL WIDE]
R6  120 Ohms  [RES 0402_1005]
S2  SS312SAH4  [NKK SS312SAH4]

### Ports
CAN_N (bidir), CAN_P (bidir), CAN_RX (bidir), CAN_STBY (in), CAN_TX (bidir)

### Nets
GND: C18.1 C19.1 IC3.2(VSS)
VCC3V3: C18.2 IC3.5(VIO)
VCC5V: C19.2 IC3.3(VDD)
CAN1_N: R6.1
CAN1_P: S2.1
CAN_N: IC3.6(CANL) ; port CAN_N
CAN_P: IC3.7(CANH) ; port CAN_P
CAN_RX: IC3.4(RXD) ; port CAN_RX
CAN_STBY: IC3.8(STBY) ; port CAN_STBY
CAN_TX: IC3.1(TXD) ; port CAN_TX
NetR6_2: R6.2 S2.2(COM)

Not connected (* = marked no-connect by the designer): S2 3

### Channels
STM32 Microcontroller/CAN1: designators end in _CAN1; ports CAN_N=CAN1_N CAN_P=CAN1_P CAN_RX=CAN1_RX CAN_STBY=CAN1_STBY CAN_TX=CAN1_TX
STM32 Microcontroller/CAN2: designators end in _CAN2; ports CAN_N=CAN2_N CAN_P=CAN2_P CAN_RX=CAN2_RX CAN_STBY=CAN2_STBY CAN_TX=CAN2_TX

### Layout directives
differential pair: CAN1_N, CAN1_P

### Library data of the parts
C18 C19 = EMK063BJ104KP-F: CAP CER 0.1UF 16V X5R 0201; Manufacturer: Taiyo Yuden; Tolerance: ±10%; Part Number: EMK063BJ104KP-F; Value: 0.1µF; Applications: General Purpose; Capacitance: 0.1µF; ComponentLink1Description: Datasheet; ComponentLink1URL: https://ds.yuden.co.jp/TYCOMPAS/ut/detail?pn=EMK063BJ104KP-F  &u=M; ComponentLink2Description: DigiKey Link; ComponentLink2URL: http://digikey.com/product-detail/en/taiyo-yuden/EMK063BJ104KP-F/587-5833-1-ND/7674954; Device Package: 0201 (0603 Metric); LastUpdated: 2020-09-02 1:00:18 AM; Lifecycle Status: Active; Minimum Order: 1; Mounting Type: Surface Mount, MLCC; Operating Temperature: -55°C ~ 85°C; Package / Case: 0201 (0603 Metric); Packaging: TapeAndReel; PartId: 12; Part Status: Active; Price: 0.02; Series: M; Size / Dimension: 0.024" L x 0.012" W (0.60mm x 0.30mm); Supplier 1: DigiKey; Supplier Part Number 1: 587-5833-1-ND; Temperature Coefficient: X5R; Thickness (Max): 0.013" (0.33mm); Voltage - Rated: 16V
IC3 = MCP2542FDT-E/SN: IC TRANSCEIVER 1/1 8SOIC; Manufacturer: Microchip Technology; Data Rate: 8Mbps; Protocol: CANbus; Receiver Hysteresis: 200mV; Voltage - Supply: 4.5V ~ 5.5V; Part Number: MCP2542FDT-E/SN; ComponentLink1Description: Datasheet; ComponentLink1URL: http://www.microchip.com/mymicrochip/filehandler.aspx?ddocname=en585412; ComponentLink2Description: DigiKey Link; ComponentLink2URL: http://digikey.com/product-detail/en/microchip-technology/MCP2542FDT-E-SN/MCP2542FDT-E-SNCT-ND/9642863; Device Package: 8-SOIC (0.154", 3.90mm Width); LastUpdated: 2020-05-24 11:07:13 PM; Lifecycle Status: Active; Minimum Order: 1; Mounting Type: Surface Mount; Number of Drivers/Receivers: 1/1; Operating Temperature: -40°C ~ 125°C; Package / Case: 8-SOIC (0.154", 3.90mm Width); Packaging: TapeAndReel; Part Status: Active; Price: 0.59; Series: -; Supplier 1: DigiKey; Supplier Part Number 1: MCP2542FDT-E/SNCT-ND; Supplier Device Package: 8-SOIC; Type: Transceiver
R6 = RC0402JR-07120RL: RES SMD 120 OHM 5% 1/16W 0402; Manufacturer: Yageo; Power (Watts): 0.063W, 1/16W; Temperature Coefficient: ±100ppm/°C; Part Number: RC0402JR-07120RL; Value: 120 Ohms; ComponentLink1Description: Datasheet; ComponentLink1URL: https://www.yageo.com/upload/media/product/productsearch/datasheet/rchip/PYu-RC_Group_51_RoHS_L_10.pdf; ComponentLink2Description: DigiKey Link; ComponentLink2URL: http://digikey.com/product-detail/en/yageo/RC0402JR-07120RL/311-120JRCT-ND/2827967; Composition: Thick Film; Device Package: 0402 (1005 Metric); Features: Moisture Resistant; Height - Seated (Max): 0.016" (0.40mm); LastUpdated: 2020-09-02 1:08:05 AM; Lifecycle Status: Active; Minimum Order: 1; Number of Terminations: 2; Operating Temperature: -55°C ~ 155°C; Package / Case: 0402 (1005 Metric); Packaging: CutTape; PartId: 4797; Part Status: Active; Price: 0.10; Resistance: 120 Ohms; Series: RC; Size / Dimension: 0.039" L x 0.020" W (1.00mm x 0.50mm); Supplier 1: DigiKey; Supplier Part Number 1: 311-120JRCT-ND; Supplier Device Package: 0402; Tolerance: ±5%
S2 = SS312SAH4: SWITCH SLIDE SPDT 0.4VA 28V; Manufacturer: NKK Switches; Actuator Length: 2.00mm; Actuator Type: Standard; Contact Timing: Shorting (MBB); Current Rating (Amps): 0.4VA (AC/DC); Switch Function: On-On; Part Number: SS312SAH4; Circuit: SPDT; ComponentLink1Description: Datasheet; ComponentLink1URL: http://www.nkkswitches.com/pdf/SS3surfaceMount-1.pdf; ComponentLink2Description: DigiKey Link; ComponentLink2URL: http://digikey.com/product-detail/en/nkk-switches/SS312SAH4/360-3250-ND/1052031; Contact Finish: Gold; Contact Material: Phosphor Bronze; LastUpdated: 2020-01-04 7:15:23 PM; Lifecycle Status: Active; Minimum Order: 1; Mounting Type: Surface Mount, Right Angle; Operating Temperature: -25°C ~ 85°C; Packaging: Tray; PartId: 2; Part Status: Active; Price: 3.02; Series: SS3; Supplier 1: DigiKey; Supplier Part Number 1: 360-3250-ND; Termination Style: Gull Wing; Voltage Rating - AC: 28V; Voltage Rating - DC: 28V

## Sheet IMU.SchDoc
size A4
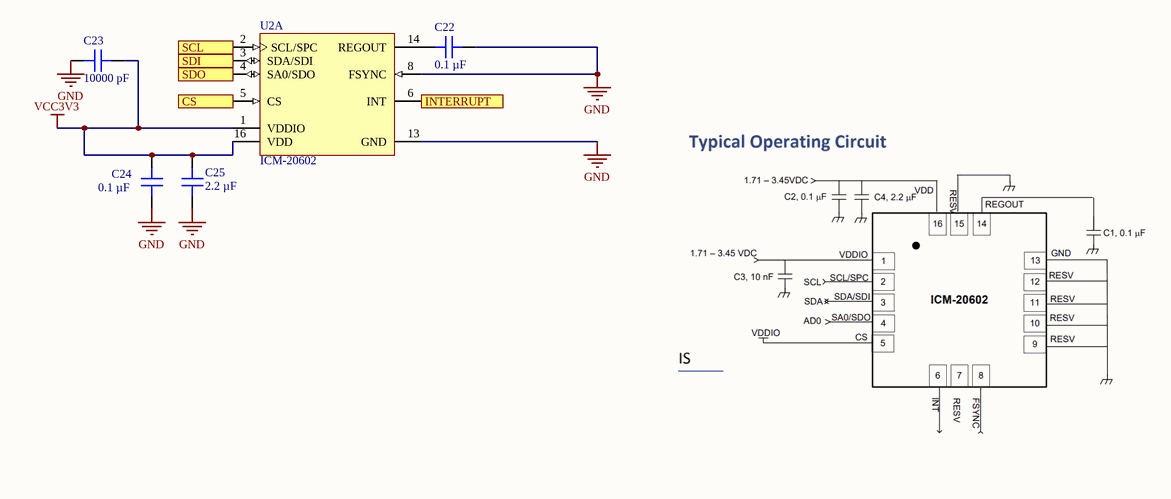
[diagram p3: IMU.SchDoc]

### Parts
C22  0.1 µF  [CAP 0603_1608]
C23  10000 pF  [CAP 0603_1608]
C24  0.1 µF  [CAP 0603_1608]
C25  2.2 µF  [CAP 0603_1608]
U2  ICM-20602  [INSE-I62-16]  (part A of 2)

### Ports
CS, INTERRUPT, SCL, SDI, SDO

### Nets
GND: C22.2 C23.1 C24.1 C25.1 U2.8(FSYNC) U2.13(GND)
VCC3V3: C23.2 C24.2 C25.2 U2.1(VDDIO) U2.16(VDD)
NetC22_1: C22.1 U2.14(REGOUT)
NetIC2_8: U2.6(INT) ; port INTERRUPT
NetIC2_33: U2.5(CS) ; port CS
NetIC2_34: U2.2(SCL/SPC) ; port SCL
NetIC2_35: U2.4(SA0/SDO) ; port SDO
NetIC2_36: U2.3(SDA/SDI) ; port SDI

### Library data of the parts
C22 C24 = C0603C104K5RAC7411: CAP CER 0.1UF 50V X7R 0603; manufacturer: KEMET; Tolerance: ±10%; Part Number: C0603C104K5RAC7411; Value: 0.1 µF; Applications: Bypass, Decoupling; Capacitance: 0.1 µF; componentlink1description: Datasheet; componentlink1url: https://api.kemet.com/component-edge/download/datasheet/C0603C104K5RAC7411.pdf; componentlink2description: DigiKey Link; componentlink2url: https://www.digikey.com/en/products/detail/kemet/C0603C104K5RAC7411/3317013; Device Package: 0603 (1608 Metric); lastupdated: 2023-06-07 7:13:18 PM; Lifecycle Status: Active; Minimum Order: 1; Mounting Type: Surface Mount, MLCC; Operating Temperature: -55°C ~ 125°C; Package / Case: 0603 (1608 Metric); packaging: TapeAndReel; partid: 2233; Part Status: Active; price: 0.01; series: SMD Comm X7R; Size / Dimension: 0.063" L x 0.031" W (1.60mm x 0.80mm); Supplier 1: DigiKey; Supplier Part Number 1: 399-C0603C104K5RAC7411CT-ND; Temperature Coefficient: X7R; Thickness (Max): 0.035" (0.90mm); Voltage - Rated: 50V
C23 = C0603C103K4RECAUTO: CAP CER 0603 10NF 16V X7R 10%; manufacturer: KEMET; Part Number: C0603C103K4RECAUTO; Value: 10000 pF; Applications: Automotive, ESD Protection; Capacitance: 10000 pF; componentlink1description: Datasheet; componentlink1url: https://api.kemet.com/component-edge/download/datasheet/C0603C103K4RECAUTO.pdf; componentlink2description: DigiKey Link; componentlink2url: https://www.digikey.com/en/products/detail/kemet/C0603C103K4RECAUTO/8640474; Device Package: 0603 (1608 Metric); lastupdated: 2023-06-07 7:13:03 PM; Lifecycle Status: Active; Minimum Order: 1; Mounting Type: Surface Mount, MLCC; Operating Temperature: -55°C ~ 125°C; Package / Case: 0603 (1608 Metric); packaging: TapeAndReel; partid: 8251; Part Status: Active; price: 0.01; Ratings: AEC-Q200; series: ESD SMD Auto X7R; Size / Dimension: 0.063" L x 0.031" W (1.60mm x 0.80mm); Supplier 1: DigiKey; Supplier Part Number 1: 399-17880-1-ND; Temperature Coefficient: X7R; Thickness (Max): 0.034" (0.87mm); Tolerance: ±10%; Voltage - Rated: 16V
C25 = CC0603ZRY5V6BB225: CAP CER 2.2UF 10V Y5V 0603; manufacturer: Yageo; Temperature Coefficient: Y5V (F); Tolerance: -20%, +80%; Part Number: CC0603ZRY5V6BB225; Value: 2.2 µF; Applications: General Purpose; Capacitance: 2.2 µF; componentlink1description: Datasheet; componentlink1url: http://www.yageo.com/documents/recent/UPY-GPHC_Y5V_6.3V-to-50V_8.pdf; componentlink2description: DigiKey Link; componentlink2url: https://www.digikey.com/en/products/detail/yageo/CC0603ZRY5V6BB225/2833615; Device Package: 0603 (1608 Metric); lastupdated: 2023-06-07 7:13:18 PM; Lifecycle Status: Active; Minimum Order: 1; Mounting Type: Surface Mount, MLCC; Operating Temperature: -30°C ~ 85°C; Package / Case: 0603 (1608 Metric); packaging: TapeAndReel; partid: 2248; Part Status: Active; price: 0.01; series: CC; Size / Dimension: 0.063" L x 0.031" W (1.60mm x 0.80mm); Supplier 1: DigiKey; Supplier Part Number 1: 311-1450-1-ND; Thickness (Max): 0.035" (0.90mm); Voltage - Rated: 10V
U2 = CMP-2000-07589-1: High Performance 6-Axis MEMS MotionTracking(TM) Device, 1.71 to 3.45 V, -40 to 85 degC, 16-Pin LGA, RoHS; Manufacturer: InvenSense; Sensor Type: Temperature; Output Type: I2C; RoHSCompliant: True; Datasheet Version: Rev. 1.0, 10/2016; Datasheet URL: http://www.invensense.com/wp-content/uploads/2016/10/DS-000176-ICM-20602-v1.0.pdf; Min Operating Temperature: -40degC; Mounting Technology: SurfaceMount; Max Operating Temperature: 85degC; Manufacturer URL: http://www.invensense.com/; Package Reference: I62-16; Package Description: 16-Pin Land Grid Array, Body 3 x 3 mm, Pitch 0.5 mm

## Sheet Single_12V.SchDoc
size A4
Used 3 times, as channels Motor Controller 1, Motor Controller 2, Steering. Parts and nets are listed once, with the designators drawn on the sheet.
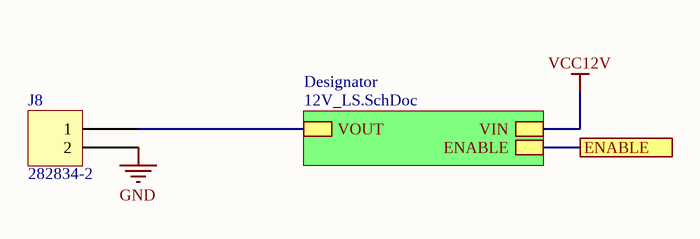
[diagram p4: Single_12V.SchDoc]

### Parts
J8  282834-2  [TE 282834-2]

### Sub-sheets
Designator = 12V_LS.SchDoc: VIN, VOUT, ENABLE

### Ports
ENABLE

### Nets
GND: J8.2
ENABLE: port ENABLE, sheet Designator/ENABLE
NetJ8_1: J8.1 ; sheet Designator/VOUT

### Channels
Motor Controller 1: designators end in _Motor_Controller_1; ports ENABLE=MC1_ENABLE
Motor Controller 2: designators end in _Motor_Controller_2; ports ENABLE=MC2_ENABLE
Steering: designators end in _Steering; ports ENABLE=STEERING_ENABLE

### Library data of the parts
J8 = 282834-2: TERM BLK 2P SIDE ENT 2.54MM PCB; Manufacturer: TE Connectivity AMP Connectors; Current: 10A; Mating Orientation: Horizontal with Board; Number of Levels: 1; Pitch: 0.100" (2.54mm); Positions Per Level: 2; Voltage: 150V; Wire Gauge: 16-30 AWG; Wire Termination: Screw - Rising Cage Clamp; Part Number: 282834-2; Color: Green; ComponentLink1Description: Datasheet; ComponentLink1URL: https://www.te.com/commerce/DocumentDelivery/DDEController?Action=srchrtrv&DocNm=282834&DocType=Customer+Drawing&DocLang=English; ComponentLink2Description: DigiKey Link; ComponentLink2URL: http://digikey.com/product-detail/en/te-connectivity-amp-connectors/282834-2/A98333-ND/1150135; LastUpdated: 2020-01-15 4:15:38 AM; Lifecycle Status: Active; Minimum Order: 1; Mounting Type: Through Hole; Packaging: Bulk; Part Status: Active; Price: 0.88; Series: Buchanan; Supplier 1: DigiKey; Supplier Part Number 1: A98333-ND

## Sheet 12V_LS.SchDoc
size A4
Used 9 times, as channels Motor Controller 1/Designator, Motor Controller 2/Designator, Steering/Designator, 12V Power And Ground/Designator, 12V Power And Ground/Designator, 12V Power And Ground/Designator, 12V Power And Ground/Designator, 12V Power And Ground/Designator, 12V Power And Ground/Designator. Parts and nets are listed once, with the designators drawn on the sheet.
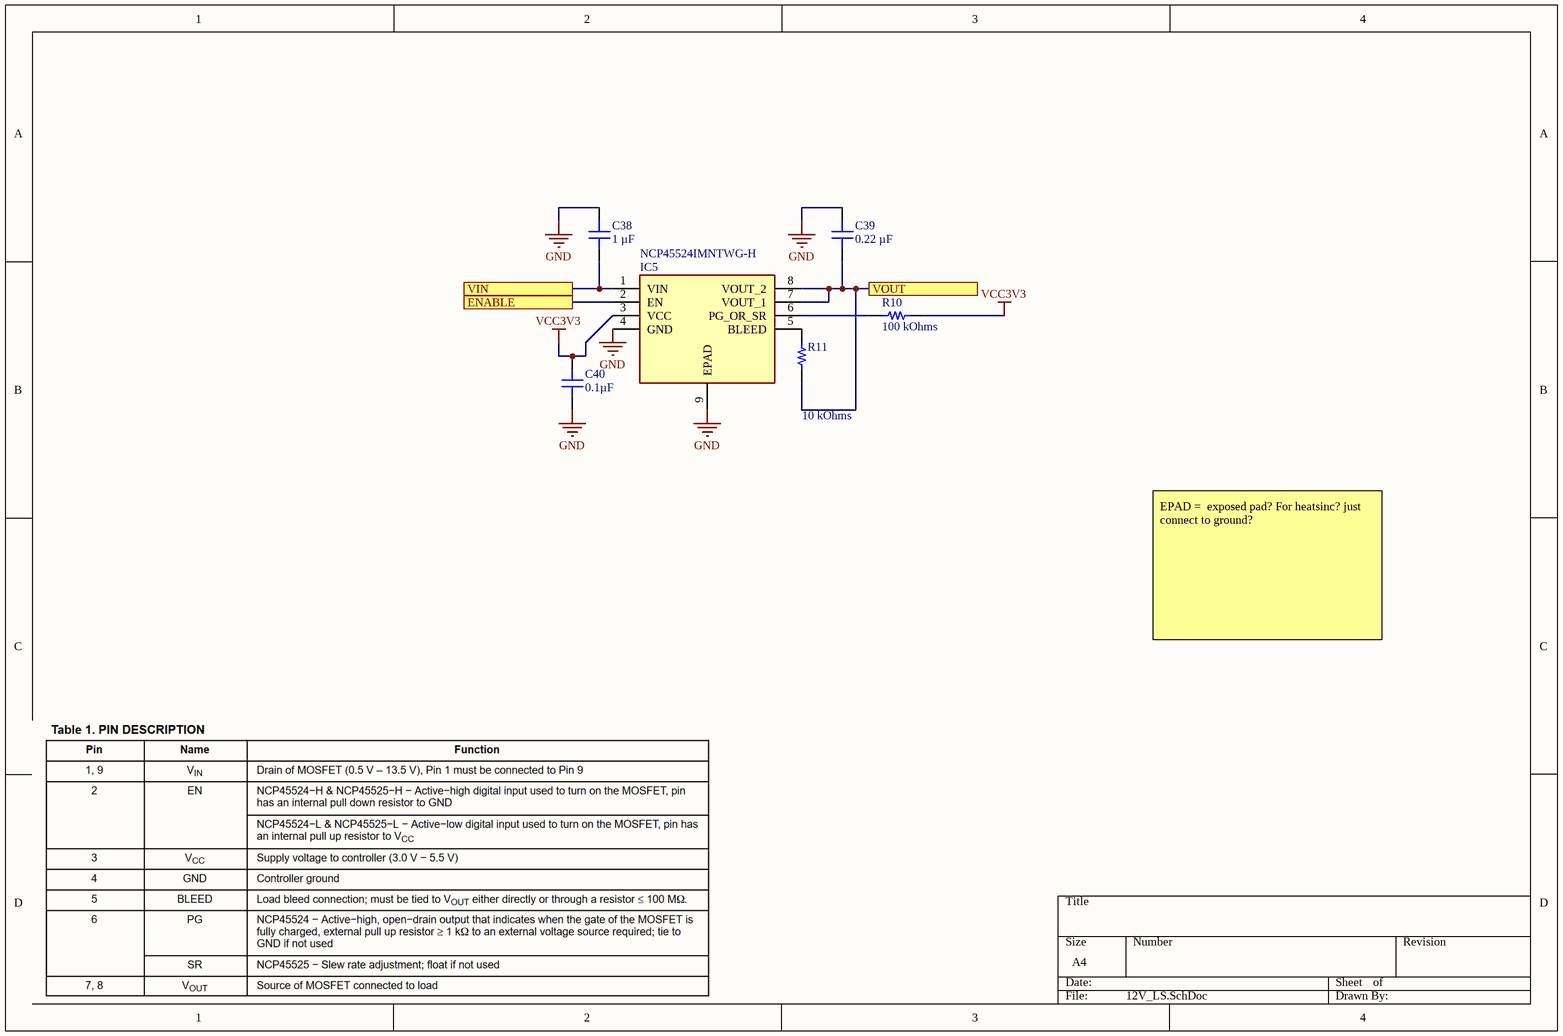
[diagram p5: 12V_LS.SchDoc]

### Parts
C38  1 µF  [CAP 0402_1005]
C39  0.22 µF  [CAP 0603_1608]
C40  0.1µF  [CAP 0402_1005]
IC5  NCP45524IMNTWG-H  [SON50P200X200X100-9N]
R10  100 kOhms  [RES 0603_1608]
R11  10 kOhms  [RES 0603_1608]

### Ports
ENABLE, VIN, VOUT

### Nets
GND: C38.2 C39.2 C40.1 IC5.4(GND) IC5.9(EPAD)
VCC3V3: C40.2 IC5.3(VCC) R10.2
ENABLE: IC5.2(EN) ; port ENABLE
VIN: C38.1 IC5.1(VIN) ; port VIN
VOUT: C39.1 IC5.7(VOUT_1) IC5.8(VOUT_2) R11.1 ; port VOUT
NetIC5_5: IC5.5(BLEED) R11.2
NetIC5_6: IC5.6(PG_OR_SR) R10.1

### Channels
Motor Controller 1/Designator: designators end in _Motor_Controller_1_Designator; ports ENABLE=MC1_ENABLE VIN=VCC12V VOUT=NetC39_Motor_Controller_1_Designator_1
Motor Controller 2/Designator: designators end in _Motor_Controller_2_Designator; ports ENABLE=MC2_ENABLE VIN=VCC12V VOUT=NetC39_Motor_Controller_2_Designator_1
Steering/Designator: designators end in _Steering_Designator; ports ENABLE=STEERING_ENABLE VIN=VCC12V VOUT=NetC39_Steering_Designator_1
12V Power And Ground/Designator: designators end in _12V_Power_And_Ground_Designator#1; ports ENABLE=NetIC5_12V_Power_And_Ground_Designator#1_2 VIN=VCC12V VOUT=NetC39_12V_Power_And_Ground_Designator#1_1
12V Power And Ground/Designator: designators end in _12V_Power_And_Ground_Designator#2; ports ENABLE=NetIC5_12V_Power_And_Ground_Designator#2_2 VIN=VCC12V VOUT=NetC39_12V_Power_And_Ground_Designator#2_1
12V Power And Ground/Designator: designators end in _12V_Power_And_Ground_Designator#3; ports ENABLE=NetIC5_12V_Power_And_Ground_Designator#3_2 VIN=VCC12V VOUT=NetC39_12V_Power_And_Ground_Designator#3_1
12V Power And Ground/Designator: designators end in _12V_Power_And_Ground_Designator#4; ports ENABLE=NetIC5_12V_Power_And_Ground_Designator#4_2 VIN=VCC12V VOUT=NetC39_12V_Power_And_Ground_Designator#4_1
12V Power And Ground/Designator: designators end in _12V_Power_And_Ground_Designator#5; ports ENABLE=NetIC5_12V_Power_And_Ground_Designator#5_2 VIN=VCC12V VOUT=NetC39_12V_Power_And_Ground_Designator#5_1
12V Power And Ground/Designator: designators end in _12V_Power_And_Ground_Designator#6; ports ENABLE=NetIC5_12V_Power_And_Ground_Designator#6_2 VIN=VCC12V VOUT=NetC39_12V_Power_And_Ground_Designator#6_1

### Notes on the sheet
- EPAD =  exposed pad? For heatsinc? just connect to ground?

### Library data of the parts
C38 = GRM155C71A105KE11D: CAP CER 1UF 10V X7S 0402; manufacturer: Murata Electronics; Tolerance: ±10%; Part Number: GRM155C71A105KE11D; Value: 1 µF; Applications: General Purpose; Capacitance: 1 µF; componentlink1description: Datasheet; componentlink1url: https://search.murata.co.jp/Ceramy/image/img/A01X/G101/ENG/GRM155C71A105KE11-01.pdf; componentlink2description: DigiKey Link; componentlink2url: https://www.digikey.com/en/products/detail/murata-electronics/GRM155C71A105KE11D/6606086; Device Package: 0402 (1005 Metric); lastupdated: 2023-06-04 7:05:15 PM; Lifecycle Status: Active; Minimum Order: 1; Mounting Type: Surface Mount, MLCC; Operating Temperature: -55°C ~ 125°C; Package / Case: 0402 (1005 Metric); packaging: TapeAndReel; partid: 1749; Part Status: Active; price: 0.01; series: GRM; Size / Dimension: 0.039" L x 0.020" W (1.00mm x 0.50mm); Supplier 1: DigiKey; Supplier Part Number 1: 490-14457-1-ND; Temperature Coefficient: X7S; Thickness (Max): 0.024" (0.60mm); Voltage - Rated: 10V
C39 = CC0603KRX7R8BB224: CAP CER 0.22UF 25V X7R 0603; manufacturer: Yageo; Tolerance: ±10%; Part Number: CC0603KRX7R8BB224; Value: 0.22 µF; Applications: General Purpose; Capacitance: 0.22 µF; componentlink1description: Datasheet; componentlink1url: https://www.yageo.com/upload/media/product/productsearch/datasheet/mlcc/UPY-GPHC_X7R_6.3V-to-50V_18.pdf; componentlink2description: DigiKey Link; componentlink2url: https://www.digikey.com/en/products/detail/yageo/CC0603KRX7R8BB224/5195211; Device Package: 0603 (1608 Metric); lastupdated: 2023-06-21 7:13:30 PM; Lifecycle Status: Active; Minimum Order: 1; Mounting Type: Surface Mount, MLCC; Operating Temperature: -55°C ~ 125°C; Package / Case: 0603 (1608 Metric); packaging: TapeAndReel; partid: 2214; Part Status: Active; price: 0.01; series: CC; Size / Dimension: 0.063" L x 0.031" W (1.60mm x 0.80mm); Supplier 1: DigiKey; Supplier Part Number 1: 311-1803-1-ND; Temperature Coefficient: X7R; Thickness (Max): 0.035" (0.90mm); Voltage - Rated: 25V
C40 = 0402ZC104KAT2A: CAP CER 0.1UF 10V X7R 0402; manufacturer: AVX Corporation; Tolerance: ±10%; Part Number: 0402ZC104KAT2A; Value: 0.1µF; Applications: General Purpose; Capacitance: 0.1µF; componentlink1description: Datasheet; componentlink1url: http://datasheets.avx.com/X7RDielectric.pdf; componentlink2description: DigiKey Link; componentlink2url: http://digikey.com/product-detail/en/avx-corporation/0402ZC104KAT2A/478-7891-1-ND/3881514; Device Package: 0402 (1005 Metric); lastupdated: 2022-02-08 12:26:59 PM; Lifecycle Status: Active; Minimum Order: 1; Mounting Type: Surface Mount, MLCC; Operating Temperature: -55°C ~ 125°C; Package / Case: 0402 (1005 Metric); packaging: TapeAndReel; partid: 1757; Part Status: Active; price: 0.09; series: -; Size / Dimension: 0.039" L x 0.020" W (1.00mm x 0.50mm); Supplier 1: DigiKey; Supplier Part Number 1: 478-7891-1-ND; Temperature Coefficient: X7R; Thickness (Max): 0.022" (0.55mm); Voltage - Rated: 10V
IC5 = NCP45524IMNTWG-H: Integrated Circuit; Manufacturer_Name: onsemi; Datasheet Link: http://www.onsemi.com/pub/Collateral/NCP45524-D.PDF; Height: 1mm; Manufacturer_Part_Number: NCP45524IMNTWG-H; Mouser Part Number: 863-NCP45524IMNTWG-H; Mouser Price/Stock: https://www.mouser.co.uk/ProductDetail/onsemi/NCP45524IMNTWG-H?qs=xGcJQ%252BnsJwsBahshTeqn2Q%3D%3D; Arrow Part Number: NCP45524IMNTWG-H; Arrow Price/Stock: https://www.arrow.com/en/products/ncp45524imntwg-h/on-semiconductor
R10 = RNCS0603BKE100K: RES 100K OHM 0.1% 1/16W 0603; Manufacturer: Stackpole Electronics Inc; Power (Watts): 0.063W, 1/16W; Temperature Coefficient: ±25ppm/°C; Part Number: RNCS0603BKE100K; Value: 100 kOhms; ComponentLink1Description: Datasheet; ComponentLink1URL: https://www.seielect.com/catalog/sei-rncs_rnch.pdf; ComponentLink2Description: DigiKey Link; ComponentLink2URL: https://www.digikey.com/en/products/detail/stackpole-electronics-inc/RNCS0603BKE100K/1708835; Composition: Thin Film; Device Package: 0603 (1608 Metric); Features: Anti-Corrosive, Automotive AEC-Q200, Moisture Resistant; Height - Seated (Max): 0.022" (0.55mm); LastUpdated: 2023-06-04 7:36:27 PM; Lifecycle Status: Active; Minimum Order: 1; Number of Terminations: 2; Operating Temperature: -55°C ~ 155°C; Package / Case: 0603 (1608 Metric); Packaging: TapeAndReel; PartId: 4849; Part Status: Active; Price: 0.07; Ratings: AEC-Q200; Resistance: 100 kOhms; Series: RNCS; Size / Dimension: 0.061" L x 0.031" W (1.55mm x 0.80mm); Supplier 1: DigiKey; Supplier Part Number 1: RNCS0603BKE100KCT-ND; Supplier Device Package: 0603; Tolerance: ±0.1%
R11 = RNCS0603BKE10K0: RES 10K OHM 0.1% 1/16W 0603; Manufacturer: Stackpole Electronics Inc; Power (Watts): 0.063W, 1/16W; Temperature Coefficient: ±25ppm/°C; Part Number: RNCS0603BKE10K0; Value: 10 kOhms; ComponentLink1Description: Datasheet; ComponentLink1URL: https://www.seielect.com/catalog/sei-rncs_rnch.pdf; ComponentLink2Description: DigiKey Link; ComponentLink2URL: https://www.digikey.com/en/products/detail/stackpole-electronics-inc/RNCS0603BKE10K0/1708836; Composition: Thin Film; Device Package: 0603 (1608 Metric); Features: Anti-Corrosive, Automotive AEC-Q200, Moisture Resistant; Height - Seated (Max): 0.022" (0.55mm); LastUpdated: 2023-06-04 7:36:27 PM; Lifecycle Status: Active; Minimum Order: 1; Number of Terminations: 2; Operating Temperature: -55°C ~ 155°C; Package / Case: 0603 (1608 Metric); Packaging: TapeAndReel; PartId: 4838; Part Status: Active; Price: 0.07; Ratings: AEC-Q200; Resistance: 10 kOhms; Series: RNCS; Size / Dimension: 0.061" L x 0.031" W (1.55mm x 0.80mm); Supplier 1: DigiKey; Supplier Part Number 1: RNCS0603BKE10K0CT-ND; Supplier Device Package: 0603; Tolerance: ±0.1%